# Altium schematic sheet Module.SchDoc
size A4
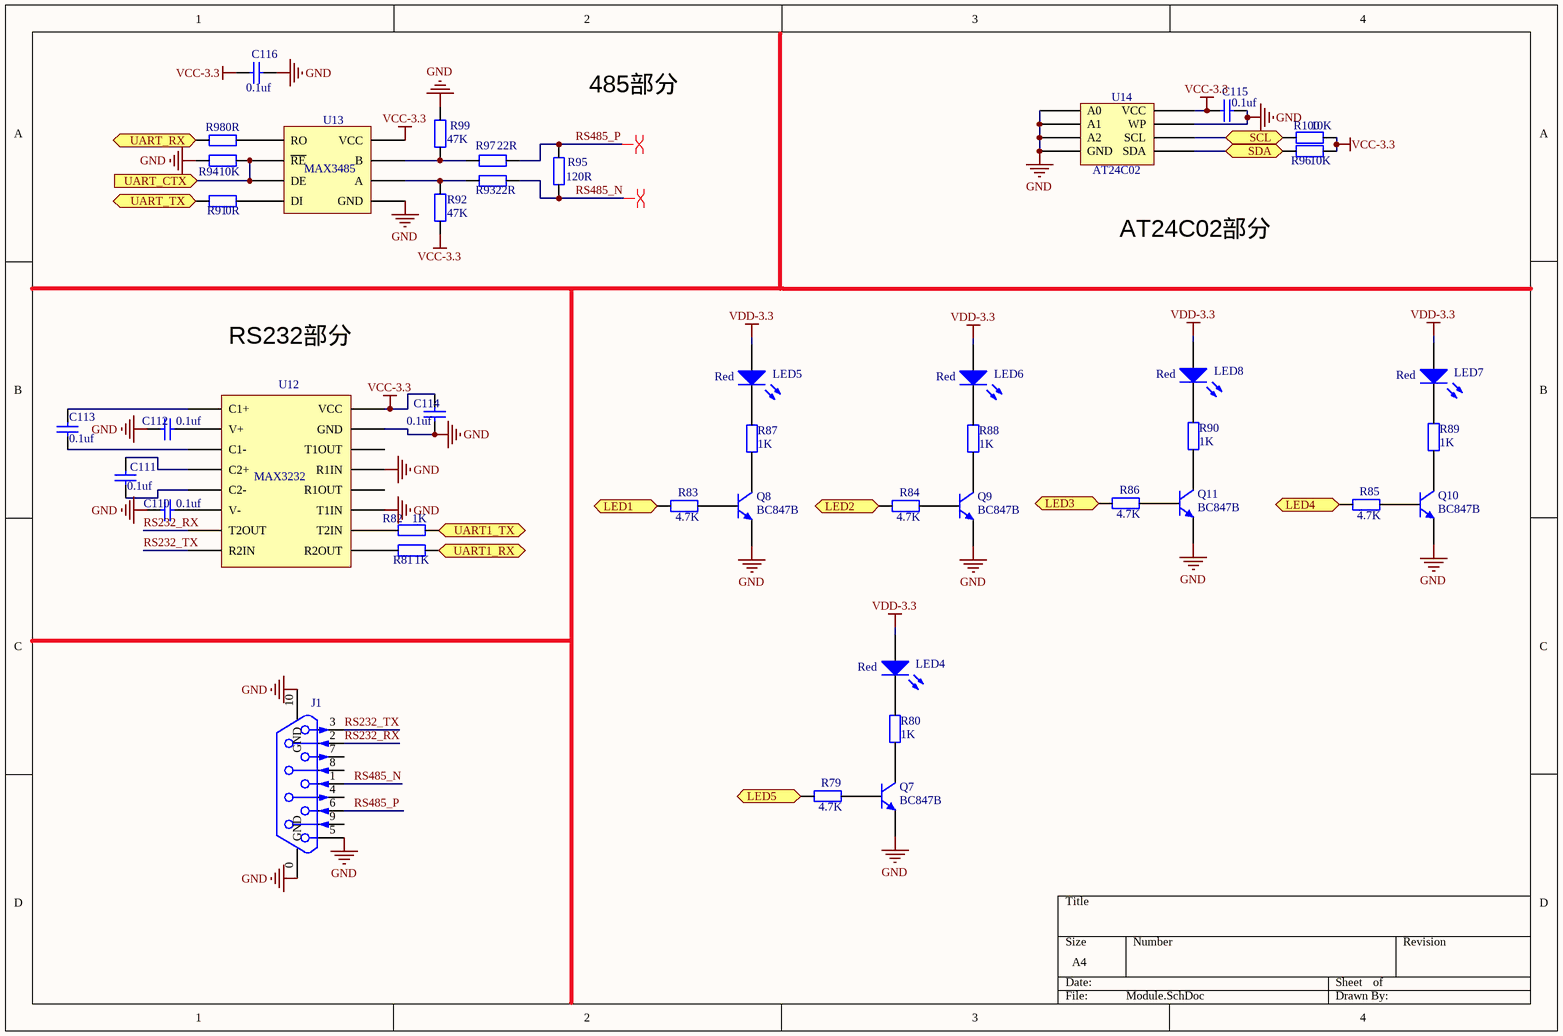
[diagram p0: Module.SchDoc]

## Parts
C110  value 0.1uf  [0603]  (hidden comment: Capacitor-0603)
C111  value 0.1uf  [0603]  (hidden comment: Capacitor-0603)
C112  value 0.1uf  [0603]  (hidden comment: Capacitor-0603)
C113  value 0.1uf  [0603]  (hidden comment: Capacitor-0603)
C114  value 0.1uf  [0603]  (hidden comment: Capacitor-0603)
C115  value 0.1uf  [0603]  (hidden comment: Capacitor-0603)
C116  value 0.1uf  [0603]  (hidden comment: Capacitor-0603)
J1  DB9  [DB9]  (value not drawn)
LED4  Color: Red  [外插小灯]  (hidden comment: LED)
LED5  Color: Red  [外插小灯]  (hidden comment: LED)
LED6  Color: Red  [外插小灯]  (hidden comment: LED)
LED7  Color: Red  [外插小灯]  (hidden comment: LED)
LED8  Color: Red  [外插小灯]  (hidden comment: LED)
Q7  BC847  [BC847B]  (value not drawn)
Q8  BC847  [BC847B]  (value not drawn)
Q9  BC847  [BC847B]  (value not drawn)
Q10  BC847  [BC847B]  (value not drawn)
Q11  BC847  [BC847B]  (value not drawn)
R79  value 4.7K  [0603]  (hidden comment: Resistor-0603)
R80  value 1K  [0603]  (hidden comment: Resistor-0603)
R81  value 1K  [0603]  (hidden comment: Resistor-0603)
R82  value 1K  [0603]  (hidden comment: Resistor-0603)
R83  value 4.7K  [0603]  (hidden comment: Resistor-0603)
R84  value 4.7K  [0603]  (hidden comment: Resistor-0603)
R85  value 4.7K  [0603]  (hidden comment: Resistor-0603)
R86  value 4.7K  [0603]  (hidden comment: Resistor-0603)
R87  value 1K  [0603]  (hidden comment: Resistor-0603)
R88  value 1K  [0603]  (hidden comment: Resistor-0603)
R89  value 1K  [0603]  (hidden comment: Resistor-0603)
R90  value 1K  [0603]  (hidden comment: Resistor-0603)
R91  value 0R  [0603]  (hidden comment: Resistor-0603)
R92  value 47K  [0603]  (hidden comment: Resistor-0603)
R93  value 22R  [0603]  (hidden comment: Resistor-0603)
R94  value 10K  [0603]  (hidden comment: Resistor-0603)
R95  value 120R  [0603]  (hidden comment: Resistor-0603)
R96  value 10K  [0603]  (hidden comment: Resistor-0603)
R97  value 22R  [0603]  (hidden comment: Resistor-0603)
R98  value 0R  [0603]  (hidden comment: Resistor-0603)
R99  value 47K  [0603]  (hidden comment: Resistor-0603)
R100  value 10K  [0603]  (hidden comment: Resistor-0603)
U12  MAX3232  [MAX3232]
U13  MAX3485  [MAX3485]
U14  AT24C02  [AT24C02]

## Ports
LED1 (in), LED2 (in), LED3 (in), LED4 (in), LED5 (in), SCL, SDA, UART1_RX (out), UART1_TX (in), UART_CTX (in), UART_RX (out), UART_TX (in)

## Nets
GND: C110.2 C112.2 C114.1 C115.1 C116.2 J1.0(GND) J1.5 J1.10(GND) Q7.1(E) Q8.1(E) Q9.1(E) Q10.1(E) Q11.1(E) R94.1 R99.2 U12.11(T1IN) U12.13(R1IN) U12.15(GND) U13.5(GND) U14.1(A0) U14.2(A1) U14.3(A2) U14.4(GND) U14.7(WP)
VCC-3.3: C114.2 C115.2 C116.1 R92.1 R96.1 R100.1 U12.16(VCC) U13.8(VCC) U14.8(VCC)
VDD-3.3: LED4.1(A) LED5.1(A) LED6.1(A) LED7.1(A) LED8.1(A)
LED1: R83.2 ; port LED1
LED2: R84.2 ; port LED2
LED3: R86.2 ; port LED3
LED4: R85.2 ; port LED4
LED5: R79.2 ; port LED5
RS232_RX: J1.2 U12.7(T2OUT)
RS232_TX: J1.3 U12.8(R2IN)
RS485_N: J1.1 R93.1 R95.2
RS485_P: J1.6 R95.1 R97.1
SCL: R100.2 U14.6(SCL) ; port SCL
SDA: R96.2 U14.5(SDA) ; port SDA
UART1_RX: R81.1 ; port UART1_RX
UART1_TX: R82.1 ; port UART1_TX
UART_CTX: R94.2 U13.2(~{RE}) U13.3(DE) ; port UART_CTX
UART_RX: R98.1 ; port UART_RX
UART_TX: R91.1 ; port UART_TX
NetC110_1: C110.1 U12.6(V-)
NetC111_1: C111.1 U12.5(C2-)
NetC111_2: C111.2 U12.4(C2+)
NetC112_1: C112.1 U12.2(V+)
NetC113_1: C113.1 U12.3(C1-)
NetC113_2: C113.2 U12.1(C1+)
NetLED4_2: LED4.2 R80.2
NetLED5_2: LED5.2 R87.2
NetLED6_2: LED6.2 R88.2
NetLED7_2: LED7.2 R89.2
NetLED8_2: LED8.2 R90.2
NetQ7_2: Q7.2(B) R79.1
NetQ7_3: Q7.3(C) R80.1
NetQ8_2: Q8.2(B) R83.1
NetQ8_3: Q8.3(C) R87.1
NetQ9_2: Q9.2(B) R84.1
NetQ9_3: Q9.3(C) R88.1
NetQ10_2: Q10.2(B) R85.1
NetQ10_3: Q10.3(C) R89.1
NetQ11_2: Q11.2(B) R86.1
NetQ11_3: Q11.3(C) R90.1
NetR81_2: R81.2 U12.9(R2OUT)
NetR82_2: R82.2 U12.10(T2IN)
NetR91_2: R91.2 U13.4(DI)
NetR92_2: R92.2 R93.2 U13.6(A)
NetR97_2: R97.2 R99.1 U13.7(B)
NetR98_2: R98.2 U13.1(RO)

Not connected (* = marked no-connect by the designer): J1 4 7 8 9; U12 12(R1OUT) 14(T1OUT)

## Layout directives
differential pair: RS485_N, RS485_P

## Notes on the sheet
- 485部分
- AT24C02部分
- RS232部分

## Library data of the parts
LED4-LED8 = LED: Value: LED
Q7-Q11 = BC847: Name: BC847B
U12 = MAX3232: Name: MAX3232
U13 = MAX3485: Name: MAX3485
U14 = AT24C02: Name: AT24C02